# EAGLE schematic microbean (EAGLE 7.5.0)
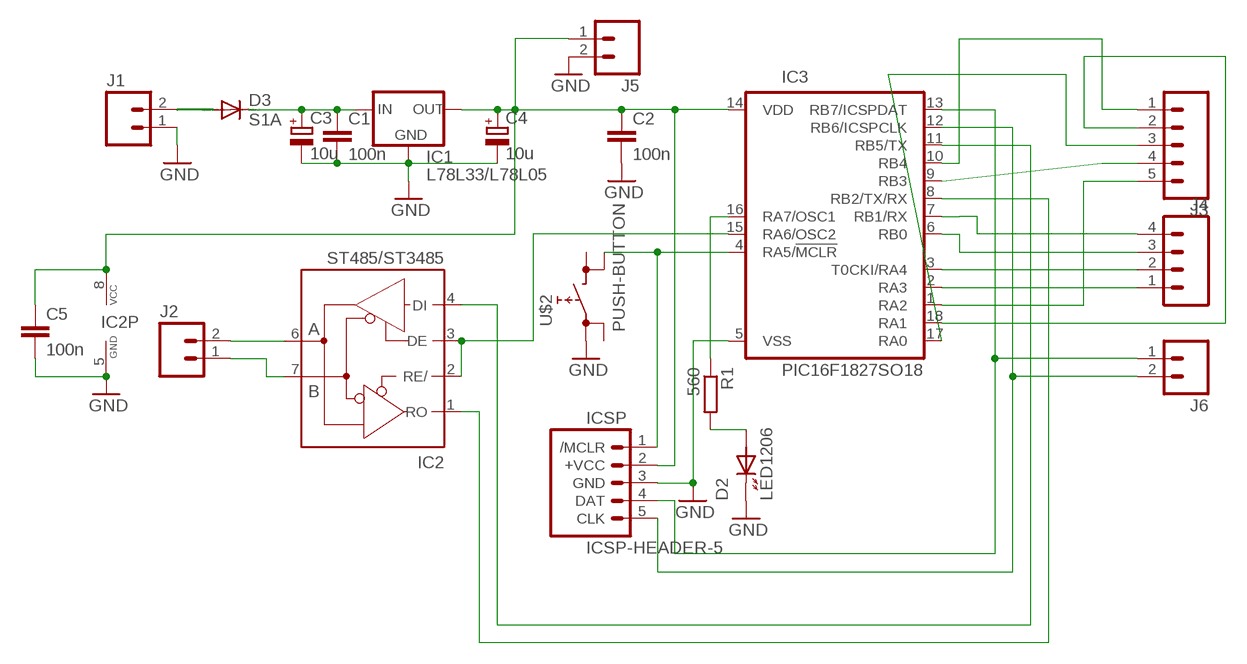
[diagram p0: schematic, sheet 1]

## Parts
C1  100n  C-EUC0805  [C0805]
C2  100n  C-EUC0805  [C0805]
C3  10u  CPOL-EUSMD4X5.3  [UD-4X5,8_NICHICON]
C4  10u  CPOL-EUSMD4X5.3  [UD-4X5,8_NICHICON]
C5  100n  C-EUC0805  [C0805]
D2  LED1206  [CHIPLED_1206]
D3  S1A  S1M  [SMA]
IC1  L78L33/L78L05  78LXXSOT89  [SOT89]
IC2  ST485/ST3485  MAX485ST3485  [SO08]
IC3  PIC16F1827SO18  [SO18W]
ICSP  ICSP-HEADER-5  [1X05]
J1  M02-SCREW-3.5MM3.5MM  [SCREWTERMINAL-3.5MM-2]
J2  M02-SCREW-3.5MM3.5MM  [SCREWTERMINAL-3.5MM-2]
J3  M05PTH  [1X05]
J4  M04  [1X04]
J5  M02  [1X02]
J6  M02  [1X02]
R1  560  R-EU_R0805  [R0805]
U$2  PUSH-BUTTON  [MICRO-SWITCH]

## Nets
A: IC2.6(A) J2.2
B: IC2.7(B) J2.1
GND: C1.2 C2.2 C3.- C4.- C5.2 D2.C(K) IC1.2(GND) IC1.2@1(GND) IC2.5(GND) IC3.5(VSS) ICSP.3(GND) J1.1 J5.2 U$2.1
MCLR: IC3.4(RA5/!MCLR) ICSP.1(/MCLR) U$2.4
N$1: D3.A J1.2
N$2: C1.1 C3.+ D3.C IC1.3(IN)
N$9: IC3.16(RA7/OSC1) R1.1
N$10: D2.A R1.2
N$23: IC2.2(RE/) IC2.3(DE) IC3.15(RA6/OSC2)
RA0: IC3.17(RA0) J3.3
RA1: IC3.18(RA1) J3.2
RA2: IC3.1(RA2) J3.5
RA3: IC3.2(RA3) J4.1
RA4: IC3.3(T0CKI/RA4) J4.2
RB0: IC3.6(RB0) J4.3
RB1: IC3.7(RB1/RX) J4.4
RB2: IC2.1(RO) IC3.8(RB2/TX/RX)
RB3: IC3.9(RB3) J3.4
RB4: IC3.10(RB4) J3.1
RB5: IC2.4(DI) IC3.11(RB5/TX)
RB6: IC3.12(RB6/ICSPCLK) ICSP.5(CLK) J6.2
RB7: IC3.13(RB7/ICSPDAT) ICSP.4(DAT) J6.1
VCC: C2.1 C4.+ C5.1 IC1.1(OUT) IC2.8(VCC) IC3.14(VDD) ICSP.2(+VCC) J5.1
Unconnected: U$2.2 U$2.3

## Library data of the parts
C1 C2 C5 = custom:C-EU: CAPACITOR, European symbol
C3 C4 = custom:CPOL-EU: POLARIZED CAPACITOR, European symbol
D2 = custom:LED
D3 = diode:S1M
IC1 = custom:78LXX: VOLTAGE REGULATOR
IC2 = custom:MAX485: RS485 TRANSEIVER
IC3 = custom:PIC16F1827: MICROCONTROLLER
ICSP = custom:ICSP-HEADER-5
J1 J2 = custom:M02-SCREW-3.5MM: Standard 2-pin 0.1" header. Use with - straight break away headers ( PRT-00116) - right angle break away headers (PRT-00553) - swiss pins (PRT-00743) - machine pins (PRT-00117) - female headers (PRT-00115) Molex polarized connector foot print use with: PRT-08233 with associated crimp pins and housings. 2.54_SCREWTERM for use with PRT-10571. 3.5mm Screw Terminal footprints for PRT-08084 5mm Screw Terminal footprints for use with PRT-08432; PROD_ID: CONN-08399
J3 = custom:M05
J4 = custom:M04
J5 J6 = custom:M02
R1 = custom:R-EU_: RESISTOR, European symbol
U$2 = custom:PUSH-BUTTON